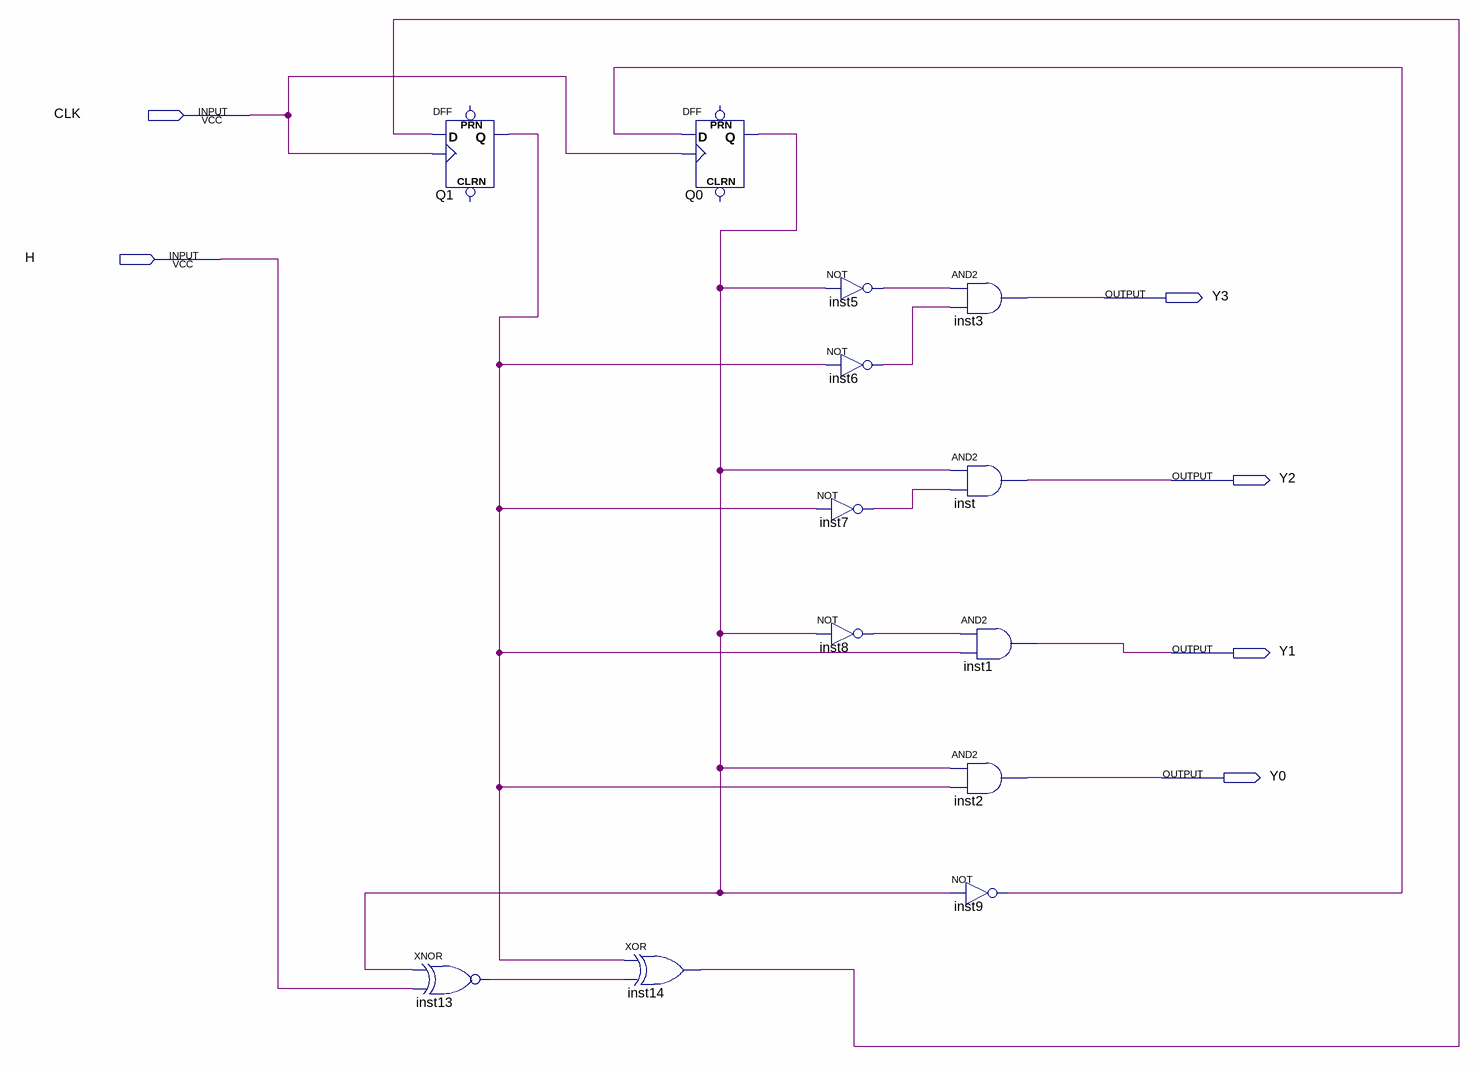
[diagram p0: schematic sheet]
// Quartus schematic Exercicio_1.bdf as structural Verilog: 13 symbols, 6 pins
module Exercicio_1 (
  input  CLK,
  input  H,
  output Y3,
  output Y2,
  output Y1,
  output Y0
);

  wire inst5_out, inst6_out, inst7_out, inst8_out, inst9_out, inst13_out, inst14_out, Q0_q, Q1_q;

  DFF Q1 (.CLK(CLK), .D(inst14_out), .Q(Q1_q));  // open: CLRN, PRN
  xnor inst13 (inst13_out, Q0_q, H);
  xor inst14 (inst14_out, Q1_q, inst13_out);
  DFF Q0 (.CLK(CLK), .D(inst9_out), .Q(Q0_q));  // open: CLRN, PRN
  not inst5 (inst5_out, Q0_q);
  not inst6 (inst6_out, Q1_q);
  not inst7 (inst7_out, Q1_q);
  not inst8 (inst8_out, Q0_q);
  and inst3 (Y3, inst5_out, inst6_out);
  and inst (Y2, Q0_q, inst7_out);
  and inst1 (Y1, inst8_out, Q1_q);
  and inst2 (Y0, Q0_q, Q1_q);
  not inst9 (inst9_out, Q0_q);
endmodule
